# Altium schematic sheet AMP_RF.SchDoc
size A; SheetNumber: 8; SheetTotal: 8
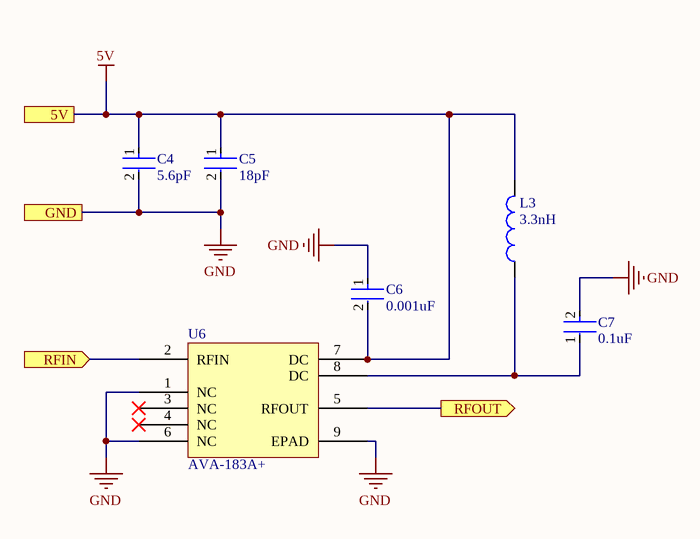
[diagram p0: AMP_RF.SchDoc]

## Parts
C4  5.6pF  [FP-0402-L_1_0_1-W_0_5_0_1-MFG]
C5  18pF  [FP-0402-L_1_0_1-W_0_5_0_1-IPC_A]
C6  0.001uF  [FP-C0402-BB-MFG]
C7  0.1uF  [FP-GRM15-MFG]
L3  3.3nH  [WE-KI_0805]
U6  AVA-183A+  [AVA-183A+ QFN]

## Ports
5V, GND, RFIN (in), RFOUT (out)

## Nets
5V: C4.1 C5.1 C6.2 L3.2 U6.7(DC) ; port 5V
GND: C4.2 C5.2 C6.1 C7.2 U6.1(NC) U6.6(NC) U6.9(EPAD) ; port GND
RFIN: U6.2(RFIN) ; port RFIN
RFOUT: U6.5(RFOUT) ; port RFOUT
NetC7_1: C7.1 L3.1 U6.8(DC)

Not connected (* = marked no-connect by the designer): U6 3(NC)* 4(NC)*

## Library data of the parts
C4 = CMP-1034-00434-3: General Purpose Ceramic Capacitor, 0402, 5.6pF, 0.25pF, C0G, 30ppm/°C, 50V; Capacitance: 5.6pF; Min Operating Temperature: -55°C; Width: 0.02inch; Thickness: 0.022inch; Termination: SMD/SMT; Case Code (Metric): 1005; Mount: Surface Mount; Voltage Rating: 50V; Voltage: 50V; Package Quantity: 1; Lead Free: Lead Free; Voltage Rating (DC): 50V; Temperature Coefficient: 30ppm/°C; Series: -; Length: 1mm; Case Code (Imperial): 0402; Depth: 0.5mm; Radiation Hardening: No; RoHS Compliant: Yes; Max Operating Temperature: 125°C; Case/Package: 0402; REACH SVHC: No SVHC; Dielectric: C0G; Packaging: Tape and Reel; Construction: Flat; Height: 0.5mm
C5 = CMP-2008-02590-2: General Purpose Ceramic Capacitor, 0402, 18pF, 1%, C0G, 30ppm/°C, 50V; Depth: 0.5mm; Packaging: Tape and Reel; Number of Pins: 2; Tolerance: 1%; Min Operating Temperature: -55°C; Capacitance: 18pF; Termination: SMD/SMT; Lead Free: Lead Free; Case Code (Metric): 1005; Radiation Hardening: No; Package Quantity: 1; Max Operating Temperature: 125°C; Voltage Rating: 50V; Construction: Flat; Dielectric: C0G; Length: 1mm; REACH SVHC: No SVHC; Case Code (Imperial): 0402; Series: -; RoHS Compliant: Yes; Voltage Rating (DC): 50V; Mount: Surface Mount; Case/Package: 0402; Width: 0.5mm; Thickness: 0.022inch; Contact Plating: Tin
C6 = CMP-2008-03052-2: CAP CER 1000PF 25V 5% NP0 0402; Manufacturer Part Number: C0402C102J3GACTU; Manufacturer: Kemet; Material: Ceramic; Capacitance: 1,000 pF; Description: C0402 1,000 pF C0G 5.00% 25 V; Value: 1,000 pF; Temperature Characteristic: C0G; Tolerance: 0.05; Temperature Coefficient: 15%; Voltage Rating: 25 V; ComponentLink2Description: Datasheet; Lead Free: Yes; Temperature Range High: +125°C; Device Class L3: Ceramic Capacitors; Category: Cap; Temperature Range Low: -55°C; Automotive: No; ComponentLink2URL: https://content.kemet.com/datasheets/KEM_C1002_X7R_SMD.pdf; Ipc Land Pattern Name: CAPC10050X50; RoHS: TRUE; Device Class L2: Capacitors; Package: C0402-BB; Mouser Description: Multilayer Ceramic Capacitors MLCC - SMD/SMT 25volts 1000pF 5% C0G; Height: 0.55mm; Digikey Description: CAP CER 1000PF 25V 5% NP0 0402; Temperature: -55°C to +125°C; Device Class L1: Passive Components; Octopart: https://octopart.com/c0402c102j3gactu-kemet-12573928
C7 = CMP-2100-03641-2: CAP CER 0.1UF 16V X7R 0402; Manufacturer Part Number: GRM155R71C104KA88D; Manufacturer: Murata; Standoff Height: 0mm; Tolerance: 10%; Description: CAP Ceramic 0.10μF 10% X7R 16Vdc 0402 SMD; Voltage Rating: 16Vdc; Material: Ceramic; Capacitance: 0.10μF; Value: 0.10μF; RoHS: TRUE; Temperature Characteristic: X7R; Octopart: https://octopart.com/grm155r71c104ka88d-murata-196880; Digikey Description: CAP CER 0.1UF 16V X7R 0402; Device Class L3: Ceramic Capacitors; Height: 0.55mm; ComponentLink2Description: Datasheet; Temperature Range Low: -55°C; Ipc Land Pattern Name: CAPC10050X219; ComponentLink2URL: https://search.murata.co.jp/Ceramy/image/img/A01X/G101/ENG/GRM155R71H471KA01-01A.pdf; Device Class L1: Passive Components; Lead Free: yes; Category: Cap; Package: GRM15; Temperature: -55°C to +125°C; Device Class L2: Capacitors; Temperature Range High: +125°C; Mouser Description: 0402 0.1 uF 16V ±10 % Tolerance X7R SMT Multilayer Ceramic Capacitor
L3 = CMP-03913-23270272-1: 744760033A WE-KI SMT Wire Wound Ceramic Inductor; Test Frequency: 1GHz; Self Resonant Frequency: 6GHz; Resistance: 60mΩ; Max DC Current: 800mA; Series Resistance: 80mΩ; Q Factor: 60; Case Code (Metric): 2012; Ambient Temperature Range High: 110°C; NexarPartId: 23270272; Width: 1.25mm; Ambient Temperature Range Low: -40°C; Height: 1.2mm; Min Operating Temperature: -40°C; Case/Package: 0805; Mount: Surface Mount; Packaging: Cut Tape; Number of Pins: 2; Weight: 40mg; Frequency: 1GHz; Core Material: Ceramic; Max Operating Temperature: 125°C; Length: 2mm; REACH SVHC: Unknown; Material: Ceramic; Depth: 1.25mm; DC Resistance (DCR): 80mΩ; Inductance: 3.3nH; Current Rating: 800mA; RoHS: Compliant; Case Code (Imperial): 0805
U6 = AVA-183A+: Wideband, Microwave, Monolithic Amplifier, 50Ω, 5 to 18 GHz